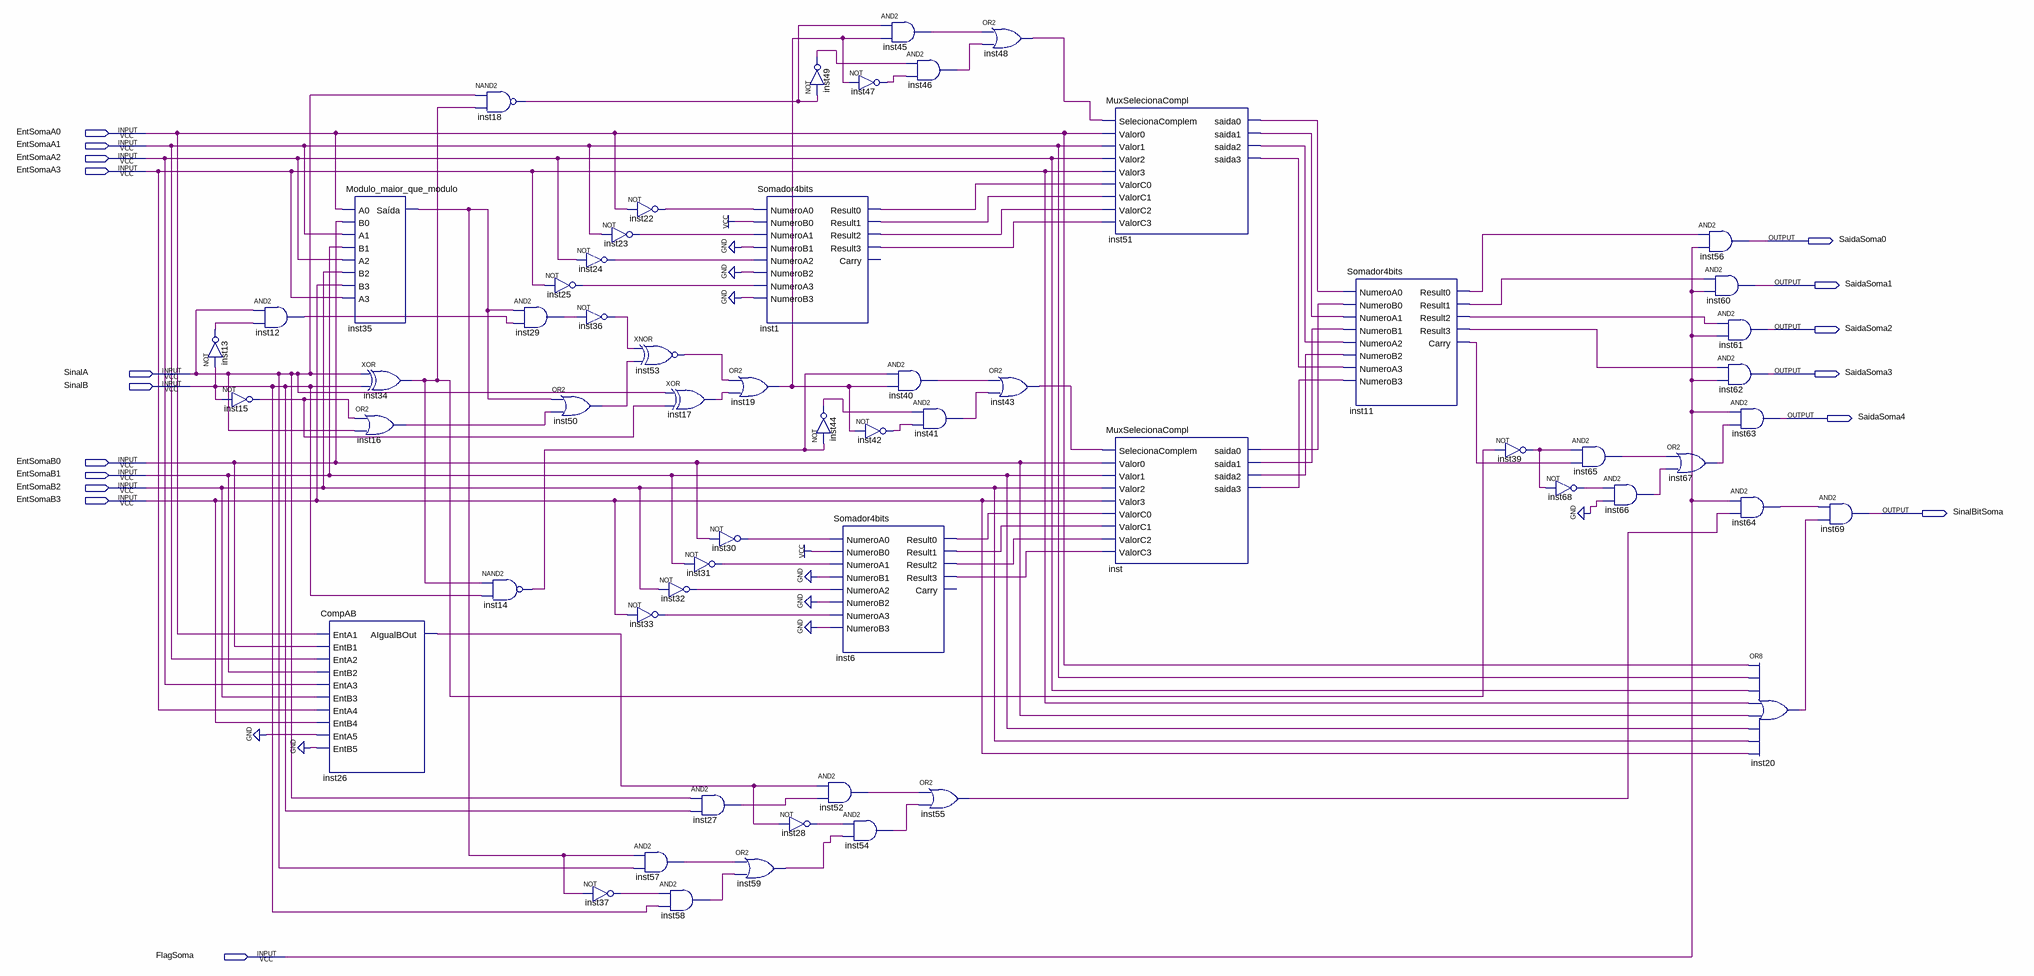
[diagram p0: schematic sheet]
// Quartus schematic SomadorCompleto.bdf as structural Verilog: 60 symbols, 17 pins
module SomadorCompleto (
  input  EntSomaA0,
  input  EntSomaA1,
  input  EntSomaA2,
  input  EntSomaA3,
  input  SinalA,
  input  SinalB,
  input  EntSomaB0,
  input  EntSomaB1,
  input  EntSomaB2,
  input  EntSomaB3,
  input  FlagSoma,
  output SaidaSoma0,
  output SaidaSoma1,
  output SaidaSoma2,
  output SaidaSoma3,
  output SaidaSoma4,
  output SinalBitSoma
);

  wire inst1_result0, inst1_result1, inst1_result2, inst1_result3, inst6_result0, inst6_result1,
       inst6_result2, inst6_result3, inst11_carry, inst11_result0, inst11_result1, inst11_result2,
       inst11_result3, inst12_out, inst13_out, inst14_out, inst15_out, inst16_out, inst17_out, inst18_out,
       inst19_out, inst20_out, inst22_out, inst23_out, inst24_out, inst25_out, inst26_aigualbout, inst27_out,
       inst28_out, inst29_out, inst30_out, inst31_out, inst32_out, inst33_out, inst34_out, \inst35_saída ,
       inst36_out, inst37_out, inst39_out, inst40_out, inst41_out, inst42_out, inst43_out, inst44_out,
       inst45_out, inst46_out, inst47_out, inst48_out, inst49_out, inst50_out, inst51_saida0, inst51_saida1,
       inst51_saida2, inst51_saida3, inst52_out, inst53_out, inst54_out, inst55_out, inst57_out, inst58_out,
       inst59_out, inst64_out, inst65_out, inst66_out, inst67_out, inst68_out, inst_saida0, inst_saida1,
       inst_saida2, inst_saida3;

  not inst13 (inst13_out, SinalB);
  and inst12 (inst12_out, SinalA, inst13_out);
  not inst15 (inst15_out, SinalB);
  Modulo_maior_que_modulo inst35 (
    .A0(EntSomaA0), .B0(EntSomaB0), .A1(EntSomaA1), .B1(EntSomaB1), .A2(EntSomaA2), .B2(EntSomaB2),
    .B3(EntSomaB3), .A3(EntSomaA3), .\Saída (\inst35_saída ));
  xor inst34 (inst34_out, SinalA, SinalB);
  or inst16 (inst16_out, inst15_out, SinalA);
  CompAB inst26 (
    .EntA1(EntSomaA0), .EntB1(EntSomaB0), .EntA2(EntSomaA1), .EntB2(EntSomaB1), .EntA3(EntSomaA2),
    .EntB3(EntSomaB2), .EntA4(EntSomaA3), .EntB4(EntSomaB3), .EntA5(1'b0), .EntB5(1'b0),
    .AIgualBOut(inst26_aigualbout));
  nand inst18 (inst18_out, SinalA, inst34_out);
  and inst29 (inst29_out, \inst35_saída , inst12_out);
  nand inst14 (inst14_out, inst34_out, SinalB);
  not inst25 (inst25_out, EntSomaA3);
  or inst50 (inst50_out, \inst35_saída , inst16_out);
  not inst23 (inst23_out, EntSomaA1);
  not inst24 (inst24_out, EntSomaA2);
  not inst36 (inst36_out, inst29_out);
  not inst37 (inst37_out, \inst35_saída );
  not inst22 (inst22_out, EntSomaA0);
  xnor inst53 (inst53_out, inst36_out, inst50_out);
  xor inst17 (inst17_out, SinalA, inst15_out);
  not inst32 (inst32_out, EntSomaB2);
  not inst33 (inst33_out, EntSomaB3);
  and inst57 (inst57_out, \inst35_saída , SinalA);
  and inst58 (inst58_out, inst37_out, SinalB);
  not inst30 (inst30_out, EntSomaB0);
  not inst31 (inst31_out, EntSomaB1);
  and inst27 (inst27_out, SinalA, SinalB);
  Somador4bits inst1 (
    .NumeroA0(inst22_out), .NumeroB0(1'b1), .NumeroA1(inst23_out), .NumeroB1(1'b0), .NumeroA2(inst24_out),
    .NumeroB2(1'b0), .NumeroA3(inst25_out), .NumeroB3(1'b0), .Result0(inst1_result0),
    .Result1(inst1_result1), .Result2(inst1_result2), .Result3(inst1_result3));  // open: Carry
  or inst19 (inst19_out, inst53_out, inst17_out);
  or inst59 (inst59_out, inst57_out, inst58_out);
  not inst49 (inst49_out, inst18_out);
  not inst44 (inst44_out, inst14_out);
  and inst52 (inst52_out, inst26_aigualbout, inst27_out);
  not inst28 (inst28_out, inst26_aigualbout);
  not inst47 (inst47_out, inst19_out);
  not inst42 (inst42_out, inst19_out);
  Somador4bits inst6 (
    .NumeroA0(inst30_out), .NumeroB0(1'b1), .NumeroA1(inst31_out), .NumeroB1(1'b0), .NumeroA2(inst32_out),
    .NumeroB2(1'b0), .NumeroA3(inst33_out), .NumeroB3(1'b0), .Result0(inst6_result0),
    .Result1(inst6_result1), .Result2(inst6_result2), .Result3(inst6_result3));  // open: Carry
  and inst54 (inst54_out, inst28_out, inst59_out);
  and inst45 (inst45_out, inst18_out, inst19_out);
  and inst46 (inst46_out, inst49_out, inst47_out);
  and inst40 (inst40_out, inst14_out, inst19_out);
  and inst41 (inst41_out, inst44_out, inst42_out);
  or inst55 (inst55_out, inst52_out, inst54_out);
  or inst48 (inst48_out, inst45_out, inst46_out);
  or inst43 (inst43_out, inst40_out, inst41_out);
  MuxSelecionaCompl inst51 (
    .SelecionaComplem(inst48_out), .Valor0(EntSomaA0), .Valor1(EntSomaA1), .Valor2(EntSomaA2),
    .Valor3(EntSomaA3), .ValorC0(inst1_result0), .ValorC1(inst1_result1), .ValorC2(inst1_result2),
    .ValorC3(inst1_result3), .saida0(inst51_saida0), .saida1(inst51_saida1), .saida2(inst51_saida2),
    .saida3(inst51_saida3));
  MuxSelecionaCompl inst (
    .SelecionaComplem(inst43_out), .Valor0(EntSomaB0), .Valor1(EntSomaB1), .Valor2(EntSomaB2),
    .Valor3(EntSomaB3), .ValorC0(inst6_result0), .ValorC1(inst6_result1), .ValorC2(inst6_result2),
    .ValorC3(inst6_result3), .saida0(inst_saida0), .saida1(inst_saida1), .saida2(inst_saida2),
    .saida3(inst_saida3));
  Somador4bits inst11 (
    .NumeroA0(inst51_saida0), .NumeroB0(inst_saida0), .NumeroA1(inst51_saida1), .NumeroB1(inst_saida1),
    .NumeroA2(inst51_saida2), .NumeroB2(inst_saida2), .NumeroA3(inst51_saida3), .NumeroB3(inst_saida3),
    .Result0(inst11_result0), .Result1(inst11_result1), .Result2(inst11_result2), .Result3(inst11_result3),
    .Carry(inst11_carry));
  not inst39 (inst39_out, inst34_out);
  and inst65 (inst65_out, inst39_out, inst11_carry);
  not inst68 (inst68_out, inst39_out);
  and inst66 (inst66_out, inst68_out, 1'b0);
  or inst67 (inst67_out, inst65_out, inst66_out);
  and inst56 (SaidaSoma0, inst11_result0, FlagSoma);
  and inst60 (SaidaSoma1, inst11_result1, FlagSoma);
  and inst61 (SaidaSoma2, inst11_result2, FlagSoma);
  and inst62 (SaidaSoma3, inst11_result3, FlagSoma);
  and inst63 (SaidaSoma4, FlagSoma, inst67_out);
  and inst64 (inst64_out, FlagSoma, inst55_out);
  or inst20 (inst20_out, EntSomaA0, EntSomaA1, EntSomaA2, EntSomaA3, EntSomaB0, EntSomaB1, EntSomaB2, EntSomaB3);
  and inst69 (SinalBitSoma, inst64_out, inst20_out);
endmodule
